# EasyEDA Pro project ProPrj_ax_driver_2025-11-09.epro, board 3-PCB_AS5047
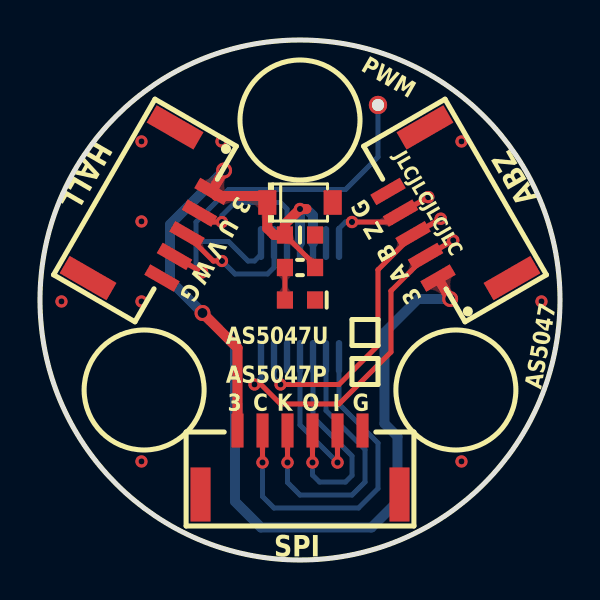
[diagram p6: board, top side]
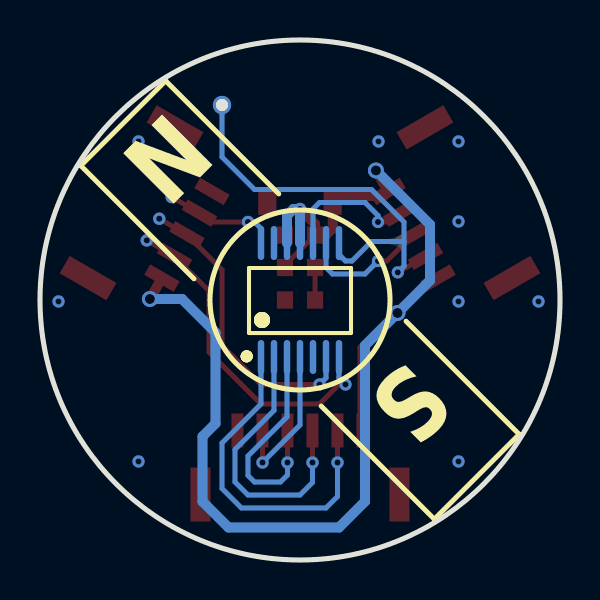
[diagram p7: board, bottom side, seen from below]

Outline 26 x 26 mm; copper layers: Top Layer, Bottom Layer. Coordinates in mm from the lower left corner of the outline.
Outline path: circle c13,13 r13
Stack: Top Layer 0.035mm / Dielectric1 1.51mm FR4 er 4.5 / Bottom Layer 0.035mm

## Design rules (mm)
spacing Default (default): track to track 0.152, other pairs 0 to 0.152
track width Default (default): min 0.152, default 0.152, max 25.4
differential pair differentialPair (default): width min 0.127, default 0.254, max 2.54; gap min 0.152, default 0.152
via Default (default): diameter min 0.508, default 0.508, max 100.025; hole min 0.305, default 0.305, max 59.995
net GND uses gge2148
pour e72 uses gge2154
pour e145 uses gge2148

## Placement (name value [footprint] x y rotation side)
C5  100n  [C0603_SMALL]  13 16.25 0 top
D1  SMFJ5.0A  [SOD-123_L2.7-W1.6-LS3.7-RD]  13 17.87 0 top
LED1  LED-0603_B  [LED0603_BLUE_SMALL]  13 13 180 top
NOREF  -  [Pad_e281]  16.9 22.75 60 top
R4  1k  [R0603_SMALL]  13 14.62 180 top
U2  AS5047U-HTSM  [SSOP-14_L5.0-W4.4-P0.65-LS6.4-BL]  13 13 180 bottom
U5  WAFER-GH1.25-5PWB  [CONN-SMD_5P-P1.25_X1251WRS-05HF-LPSW#2]  5.96 17.06 240 top
U6  WAFER-GH1.25-5PWB  [CONN-SMD_5P-P1.25_X1251WRS-05HF-LPSW]  20.04 17.06 120 top
U7  WAFER-GH1.25-6PWB  [CONN-SMD_6P-H-P1.25-L_X1251WRS-06HF-LPSW]  13 4.88 0 top

## Footprints (pads in the part's own frame, mm; a bottom-side part is the same pattern mirrored in y, then rotated)
C0603_SMALL
  rect 0.806x0.864 smd: 1(-0.753,0) 2(0.753,0)
CONN-SMD_5P-P1.25_X1251WRS-05HF-LPSW
  rect 0.6x1.7 smd: 1(-2.5,1.6) 2(-1.25,1.6) 3(0,1.6) 4(1.25,1.6) 5(2.5,1.6)
  rect 1x2.7 smd: 6(4.35,-1.6) 7(-4.35,-1.6)
CONN-SMD_5P-P1.25_X1251WRS-05HF-LPSW#2
  rect 0.6x1.7 smd: 1(-2.5,1.6) 2(-1.25,1.6) 3(0,1.6) 4(1.25,1.6) 5(2.5,1.6)
  rect 1x2.7 smd: 6(4.35,-1.6) 7(-4.35,-1.6)
CONN-SMD_6P-H-P1.25-L_X1251WRS-06HF-LPSW
  rect 0.6x1.7 smd: 1(-3.125,1.6) 2(-1.875,1.6) 3(-0.625,1.6) 4(0.625,1.6) 5(1.875,1.6) 6(3.125,1.6)
  rect 1x2.7 smd: 7(4.975,-1.6) 8(-4.975,-1.6)
LED0603_BLUE_SMALL
  rect 0.806x0.864 smd: 1(0.753,0) 2(-0.753,0)
Pad_e281
  round 0.914 hole 0.61: 1(0,0)
R0603_SMALL
  rect 0.806x0.864 smd: 1(-0.753,0) 2(0.753,0)
SOD-123_L2.7-W1.6-LS3.7-RD
  rect 0.91x1.22 smd: 1(-1.635,0) 2(1.635,0)
SSOP-14_L5.0-W4.4-P0.65-LS6.4-BL
  oval 0.32x1.7 smd: 1(-1.95,-2.85) 2(-1.3,-2.85) 3(-0.65,-2.85) 4(0,-2.85) 5(0.65,-2.85) 6(1.3,-2.85) 7(1.95,-2.85) 8(1.95,2.85) 9(1.3,2.85) 10(0.65,2.85) 11(0,2.85) 12(-0.65,2.85) 13(-1.3,2.85) 14(-1.95,2.85)

## Nets
GND: C5.2 D1.2 LED1.2 U2.5 U2.13 U5.5 U5.6 U5.7 U6.5 U6.6 U6.7 U7.6 U7.7 U7.8
VCC: C5.1 D1.1 R4.1 U2.11 U2.12 U5.1 U6.1 U7.1
A: U2.7 U6.2
B: U2.6 U6.3
CSN: U2.1 U7.2
R4_2: LED1.1 R4.2
SCK: U2.2 U7.3
SDI: U2.4 U7.5
SDO: U2.3 U7.4
U: U2.10 U5.2
V: U2.9 U5.3
W: NOREF.1 U2.8 U5.4
Z: U2.14 U6.4

## Via types
v1: diameter 0.61, hole 0.305, Top Layer to Bottom Layer, 14 vias
v2: diameter 0.62, hole 0.31, Top Layer to Bottom Layer, 9 vias
v3: diameter 0.8, hole 0.5, Top Layer to Bottom Layer, 3 vias

## Routing (per net, layer and track width the routed paths; a pad name or vN(x,y) marks a point on that pad's centre or on a via; arc(x,y) is an arc through that point)
GND:
  vias: v1(1.07,12.93) v1(5.07,20.93) v1(5.07,16.93) v1(5.07,12.93) v1(5.07,4.93) v1(9.07,20.93) v1(21.07,20.93) v1(21.07,4.93) v1(25.07,12.93)
VCC: length 63.3
  Top Layer w0.25: 12.25,16.25 13.75,14.74 13.75,14.63
  Top Layer w0.5: 19.9,14.1 20.51,13.05 ; 9.88,6.47 9.88,10.6 8.13,12.35 ; 9.2,19.47 U5.1 8.83,18.2 11.04,18.2 D1.1 11.36,16.58 11.7,16.25 12.25,16.25 12.25,16.8 13,17.55 13.32,17.55
  Bottom Layer w0.5: U2.12 13.65,17.22 13.32,17.55 13,17.55 U2.11 ; 20.51,13.05 18.9,13.05 17.22,11.37 17.22,6.83 17.87,6.17 17.87,2.92 16.57,1.63 11.05,1.63 9.75,2.92 9.75,10.73 6.5,13.98 6.5,16.77 9.2,19.48
  vias: v2(13,17.55) v3(8.12,12.35) v3(9.2,19.48) v3(20.51,13.05)
A: length 16.6
  Top Layer w0.25: 11.05,8.78 12.02,7.8 14.95,7.8 17.55,10.4 17.55,13.45 U6.2 ; 19.28,15.18 20.66,15.98
  Bottom Layer w0.25: 10.73,8.78 11.05,9.1 11.05,10.15
  vias: v1(10.72,8.78) v2(20.66,15.98)
B: length 14.7
  Top Layer w0.25: U6.3 16.9,14.51 16.9,10.72 14.95,8.78 12.35,8.78 ; 18.65,16.26 v2(20.04,17.06)
  Bottom Layer w0.25: v1(12.02,8.78) 11.7,9.1 U2.6
CSN: length 17.1
  Top Layer w0.25: 11.13,6.47 11.13,4.87
  Bottom Layer w0.25: U2.1 14.95,7.8 16.9,5.85 16.9,3.57 15.93,2.6 11.7,2.6 11.13,3.18 11.13,4.87
  vias: v2(11.12,4.88)
R4_2: length 1.6
  Top Layer w0.25: 12.25,14.63 LED1.1
SCK: length 14.1
  Top Layer w0.25: 12.38,6.47 12.38,4.87
  Bottom Layer w0.25: U2.2 14.3,7.48 16.25,5.53 16.25,3.9 15.6,3.25 13,3.25 12.38,3.88 12.38,4.87
  vias: v2(12.38,4.88)
SDI: length 7.7
  Top Layer w0.25: 14.87,6.47 14.87,4.87
  Bottom Layer w0.25: U2.4 13,6.75 14.87,4.87
  vias: v2(14.88,4.88)
SDO: length 11.2
  Top Layer w0.25: 13.62,6.47 13.62,4.87
  Bottom Layer w0.25: U2.3 13.65,7.15 15.6,5.2 15.6,4.22 15.28,3.9 13.98,3.9 13.62,4.25 13.62,4.87
  vias: v2(13.62,4.88)
U: length 7
  Top Layer w0.25: v1(9.1,16.9) 8.42,16.9 U5.2
  Bottom Layer w0.25: v1(9.1,16.9) 9.1,17.22 9.75,17.87 12.02,17.87 12.35,17.55 U2.10
V: length 6.5
  Top Layer w0.25: U5.3 8.66,14.95 v1(9.1,14.95)
  Bottom Layer w0.25: v1(9.1,14.95) 9.75,14.3 11.37,14.3 11.7,14.63 U2.9
W: length 21.7
  Top Layer w0.25: U5.4 v1(8.11,14.38)
  Bottom Layer w0.25: 7.8,15.93 7.8,16.9 9.43,18.52 15.28,18.52 16.9,20.15 16.9,22.75 ; 7.8,15.93 7.8,14.69 v1(8.11,14.38) ; 7.8,15.93 9.43,15.93 10.4,14.95 10.72,14.95 11.05,15.28 U2.8
Z: length 5.7
  Top Layer w0.25: 15.6,16.9 17.58,16.9 U6.4 v2(19.41,18.15)
  Bottom Layer w0.25: U2.14 14.95,16.58 15.28,16.9 15.6,16.9
  vias: v2(15.6,16.9)

## Copper pours and planes (outline as drawn; the poured copper is in the pictures)
GND on Top Layer: -2,28 -2,-2 27.52,-2 27.52,28
GND on Bottom Layer: -2,28 28,28 28,-2 -2,-2

Small or netless copper shapes (teardrops, artwork), in the pictures only: 39 on Top Layer, 27 on Bottom Layer

## Text on the board
Bottom Silkscreen Layer: S | N
Top Silkscreen Layer: JLCJLCJLCJLC | AS5047U | AS5047P | 3 | C | K | O | I | G | AS5047 | Z | B | A | W | V | U | PWM | SPI | ABZ | HALL
